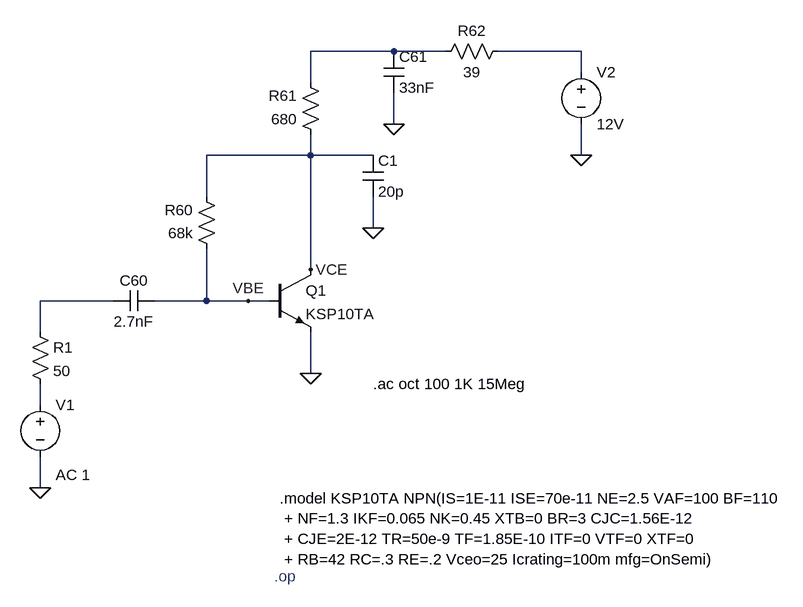
[diagram p0: schematic IF2.asc]
IF2.asc, the LTspice schematic file:
Version 4.1
SHEET 1 1060 680
WIRE 192 -512 64 -512
WIRE 272 -512 192 -512
WIRE 480 -512 352 -512
WIRE 480 -480 480 -512
WIRE 64 -464 64 -512
WIRE 192 -400 192 -448
WIRE 64 -352 64 -384
WIRE 64 -352 -96 -352
WIRE 160 -352 64 -352
WIRE 480 -352 480 -400
WIRE -96 -288 -96 -352
WIRE 160 -240 160 -288
WIRE 64 -176 64 -352
WIRE -240 -128 -352 -128
WIRE -96 -128 -96 -208
WIRE -96 -128 -176 -128
WIRE -32 -128 -96 -128
WIRE 0 -128 -32 -128
WIRE -352 -80 -352 -128
WIRE 64 -16 64 -80
WIRE -352 32 -352 0
WIRE -352 160 -352 112
FLAG 64 -16 0
FLAG 192 -400 0
FLAG 480 -352 0
FLAG -32 -128 VBE
FLAG 64 -176 VCE
FLAG -352 160 0
FLAG 160 -240 0
SYMBOL cap -176 -144 R90
WINDOW 0 0 32 VBottom 2
WINDOW 3 32 32 VTop 2
SYMATTR InstName C60
SYMATTR Value 2.7nF
SYMBOL res -80 -192 R180
WINDOW 0 36 76 Left 2
WINDOW 3 36 40 Left 2
SYMATTR InstName R60
SYMATTR Value 68k
SYMBOL npn 0 -176 R0
SYMATTR InstName Q1
SYMATTR Value KSP10TA
SYMBOL res 80 -368 R180
WINDOW 0 36 76 Left 2
WINDOW 3 36 40 Left 2
SYMATTR InstName R61
SYMATTR Value 680
SYMBOL cap 176 -512 R0
SYMATTR InstName C61
SYMATTR Value 33nF
SYMBOL res 256 -496 R270
WINDOW 0 32 56 VTop 2
WINDOW 3 0 56 VBottom 2
SYMATTR InstName R62
SYMATTR Value 39
SYMBOL voltage 480 -496 R0
SYMATTR InstName V2
SYMATTR Value 12V
SYMBOL res -368 -96 R0
SYMATTR InstName R1
SYMATTR Value 50
SYMBOL voltage -352 16 R0
WINDOW 123 24 124 Left 2
WINDOW 39 0 0 Left 0
SYMATTR InstName V1
SYMATTR Value ""
SYMATTR Value2 AC 1
SYMBOL cap 144 -352 R0
SYMATTR InstName C1
SYMATTR Value 20p
TEXT 16 176 Left 2 !.model KSP10TA NPN(IS=1E-11 ISE=70e-11 NE=2.5 VAF=100 BF=110\n + NF=1.3 IKF=0.065 NK=0.45 XTB=0 BR=3 CJC=1.56E-12\n + CJE=2E-12 TR=50e-9 TF=1.85E-10 ITF=0 VTF=0 XTF=0\n + RB=42 RC=.3 RE=.2 Vceo=25 Icrating=100m mfg=OnSemi)
TEXT 8 296 Left 2 ;.op
TEXT 160 0 Left 2 !.ac oct 100 1K 15Meg

The netlist it stands for:
* IF2.asc
C60 VBE N003 2.7nF
R60 VBE VCE 68k
Q1 VCE VBE 0 0 KSP10TA
R61 VCE N001 680
C61 N001 0 33nF
R62 N001 N002 39
V2 N002 0 12V
R1 N003 N004 50
V1 N004 0 AC 1
C1 VCE 0 20p
.model NPN NPN
.model PNP PNP
.lib standard.bjt
.model KSP10TA NPN(IS=1E-11 ISE=70e-11 NE=2.5 VAF=100 BF=110
 + NF=1.3 IKF=0.065 NK=0.45 XTB=0 BR=3 CJC=1.56E-12
 + CJE=2E-12 TR=50e-9 TF=1.85E-10 ITF=0 VTF=0 XTF=0
 + RB=42 RC=.3 RE=.2 Vceo=25 Icrating=100m mfg=OnSemi)
* .op
.ac oct 100 1K 15Meg
.backanno
.end